# Altium schematic sheet Mechanical.SchDoc: Mechanical
size A4; Date: Not used; ApprovedBy: Not used; CheckedBy: Not used; Author: Not used; CompanyName: STMicroelectronics; DrawnBy: Not used; Engineer: Not used; Organization: Not used; Address1: Not used; Address2: Not used; Address3: Not used; Address4: Not used; DocumentNumber: 8; Revision: Not used; SheetNumber: 8; SheetTotal: 8; CurrentTime: Not used; CurrentDate: Not used; Time: Not used; DocumentFullPathAndName: Not used; DocumentName: Not used; ModifiedDate: Not used; ImagePath: Not used; ProjectName: Not used; Application_BuildNumber: Not used
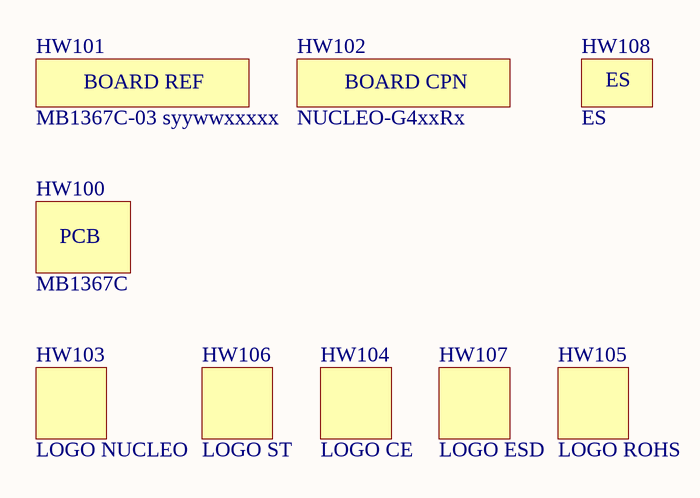
[diagram p0: Mechanical.SchDoc]

## Parts
HW100  value MB1367C  (mechanical)
HW101  value MB1367C-03 syywwxxxxx  [STICKER_BOARD-REF_25X5]  (mechanical)
HW102  value NUCLEO-G4xxRx  (mechanical)
HW103  value LOGO NUCLEO  [LOGO_NUCLEO]  (no BOM)
HW104  value LOGO CE  [LOGO_CE]  (no BOM)
HW105  value LOGO ROHS  [LOGO_ROHS]  (no BOM)
HW106  value LOGO ST  [LOGO_ST]  (no BOM)
HW107  value LOGO ESD  [LOGO_MAIN_1]  (no BOM)
HW108  value ES  (hidden comment: STICKER_ES)  (mechanical)

## Notes on the sheet
- Title:
- Project:
- Size:
- Revision:
- Variant:
- A4
- -
- Date:
- Reference:
- Sheet:
- of
- (in symbol MCD-00235) BOARD REF
- (in symbol MCD-00549) BOARD CPN

## Library data of the parts
HW100 = MCD-00216: PCB, xxxx for PCB ref, Y for revision; Part_Type: Mechanical; Provided_By: Subcon; Initial_Board_Reference: MB1319; Internal_Part_Number: MCD-00216; Status: Released; ECCN_US: n/a; ECCN_EU: n/a
HW101 = MCD-00235: Board sticker to mention board reference + serial number + QR code; Part_Type: Mechanical; Manufacturer_Part_Number: NA; Provided_By: Subcon; Initial_Board_Reference: MB1319; Internal_Part_Number: MCD-00235; ECCN_US: n/a; ECCN_EU: n/a; Status: Footprint available; Manufacturer: NA; ComponentLink1Description: NA; ComponentLink1URL: NA
HW102 = MCD-00549: Product sticker to mention product CPN + product FG; Part_Type: Mechanical; Provided_By: Subcon; Initial_Board_Reference: MB1319; Internal_Part_Number: MCD-00549; ECCN_US: n/a; ECCN_EU: n/a; Status: Released
HW103 = MCD-00636: "NUCLEO" logo footprint for PCB; Part_Type: Mechanical; Initial_Board_Reference: MB1331; Internal_Part_Number: MCD-00636; Status: Released; ECCN_US: n/a; ECCN_EU: n/a; Provided_By: n/a
HW104 = MCD-00626: "CE" logo footprint for PCB; Part_Type: Mechanical; Initial_Board_Reference: MB1331; Internal_Part_Number: MCD-00626; Status: Released; ECCN_US: n/a; ECCN_EU: n/a; Provided_By: n/a
HW105 = MCD-00628: "ROHS" logo footprint for PCB; Part_Type: Mechanical; Initial_Board_Reference: MB1331; Internal_Part_Number: MCD-00628; Status: Released; ECCN_US: n/a; ECCN_EU: n/a; Provided_By: n/a
HW106 = MCD-00625: "STMicroelectronics" logo footprint for PCB; Part_Type: Mechanical; Initial_Board_Reference: MB1331; Internal_Part_Number: MCD-00625; Status: Released; ECCN_US: n/a; ECCN_EU: n/a; Provided_By: n/a; Manufacturer_Part_Number: n/a; Manufacturer: n/a; ComponentLink1Description: n/a; ComponentLink1URL: http://na
HW107 = MCD-00627: "Hand" ESD logo footprint for PCB; Part_Type: Mechanical; Initial_Board_Reference: MB1331; Internal_Part_Number: MCD-00627; Status: Released; ECCN_US: n/a; ECCN_EU: n/a; Provided_By: n/a; Manufacturer_Part_Number: n/a; Manufacturer: n/a; ComponentLink1Description: n/a; ComponentLink1URL: http://na
HW108 = MCD-00234: Sticker to mention ES sample; Part_Type: Mechanical; Provided_By: Subcon; Initial_Board_Reference: MB1319; Internal_Part_Number: MCD-00234; Status: Released; ECCN_US: n/a; ECCN_EU: n/a